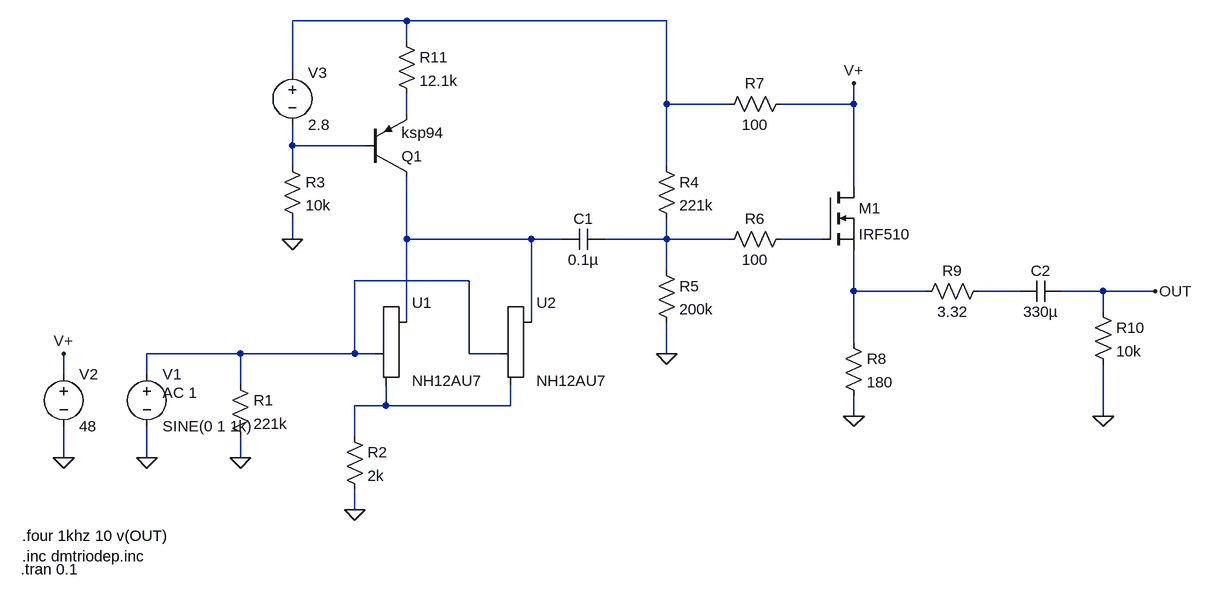
[diagram p0: schematic StarvingStudent_spice.asc]
StarvingStudent_spice.asc, the LTspice schematic file:
Version 4
SHEET 1 1892 680
WIRE 672 -624 496 -624
WIRE 1072 -624 672 -624
WIRE 672 -592 672 -624
WIRE 496 -544 496 -624
WIRE 1072 -496 1072 -624
WIRE 1168 -496 1072 -496
WIRE 1360 -496 1360 -528
WIRE 1360 -496 1248 -496
WIRE 672 -480 672 -512
WIRE 496 -432 496 -464
WIRE 608 -432 496 -432
WIRE 496 -400 496 -432
WIRE 1072 -400 1072 -496
WIRE 1360 -368 1360 -496
WIRE 496 -288 496 -320
WIRE 672 -288 672 -384
WIRE 864 -288 672 -288
WIRE 912 -288 864 -288
WIRE 1072 -288 1072 -320
WIRE 1072 -288 976 -288
WIRE 1168 -288 1072 -288
WIRE 1312 -288 1248 -288
WIRE 1072 -240 1072 -288
WIRE 768 -224 592 -224
WIRE 1360 -208 1360 -272
WIRE 1472 -208 1360 -208
WIRE 1616 -208 1552 -208
WIRE 1744 -208 1680 -208
WIRE 1824 -208 1744 -208
WIRE 1744 -176 1744 -208
WIRE 672 -160 672 -288
WIRE 864 -160 864 -288
WIRE 1360 -128 1360 -208
WIRE 416 -112 272 -112
WIRE 592 -112 592 -224
WIRE 592 -112 416 -112
WIRE 624 -112 592 -112
WIRE 768 -112 768 -224
WIRE 816 -112 768 -112
WIRE 1072 -112 1072 -160
WIRE 144 -80 144 -112
WIRE 272 -80 272 -112
WIRE 416 -64 416 -112
WIRE 640 -32 640 -64
WIRE 640 -32 592 -32
WIRE 832 -32 832 -64
WIRE 832 -32 640 -32
WIRE 1360 -16 1360 -48
WIRE 1744 -16 1744 -96
WIRE 592 16 592 -32
WIRE 144 48 144 0
WIRE 272 48 272 0
WIRE 416 48 416 16
WIRE 592 128 592 96
FLAG 416 48 0
FLAG 272 48 0
FLAG 592 128 0
FLAG 1072 -112 0
FLAG 1360 -528 V+
FLAG 1360 -16 0
FLAG 1744 -16 0
FLAG 1824 -208 OUT
FLAG 144 48 0
FLAG 144 -112 V+
FLAG 496 -288 0
SYMBOL res 400 -80 R0
SYMATTR InstName R1
SYMATTR Value 221k
SYMBOL voltage 272 -96 R0
WINDOW 123 24 44 Left 2
WINDOW 39 0 0 Left 0
SYMATTR InstName V1
SYMATTR Value SINE(0 1 1k)
SYMATTR Value2 AC 1
SYMBOL Misc\\triode 672 -112 R0
SYMATTR InstName U1
SYMATTR Value NH12AU7
SYMBOL Misc\\triode 864 -112 R0
SYMATTR InstName U2
SYMATTR Value NH12AU7
SYMBOL res 576 0 R0
SYMATTR InstName R2
SYMATTR Value 2k
SYMBOL cap 976 -304 R90
WINDOW 0 0 32 VBottom 2
WINDOW 3 32 32 VTop 2
SYMATTR InstName C1
SYMATTR Value 0.1µ
SYMBOL res 1056 -416 R0
SYMATTR InstName R4
SYMATTR Value 221k
SYMBOL res 1056 -256 R0
SYMATTR InstName R5
SYMATTR Value 200k
SYMBOL res 1264 -304 R90
WINDOW 0 0 56 VBottom 2
WINDOW 3 32 56 VTop 2
SYMATTR InstName R6
SYMATTR Value 100
SYMBOL nmos 1312 -368 R0
SYMATTR InstName M1
SYMATTR Value IRF510
SYMBOL res 1264 -512 R90
WINDOW 0 0 56 VBottom 2
WINDOW 3 32 56 VTop 2
SYMATTR InstName R7
SYMATTR Value 100
SYMBOL res 1344 -144 R0
SYMATTR InstName R8
SYMATTR Value 180
SYMBOL res 1568 -224 R90
WINDOW 0 0 56 VBottom 2
WINDOW 3 32 56 VTop 2
SYMATTR InstName R9
SYMATTR Value 3.32
SYMBOL cap 1680 -224 R90
WINDOW 0 0 32 VBottom 2
WINDOW 3 32 32 VTop 2
SYMATTR InstName C2
SYMATTR Value 330µ
SYMBOL res 1728 -192 R0
SYMATTR InstName R10
SYMATTR Value 10k
SYMBOL voltage 144 -96 R0
WINDOW 123 0 0 Left 0
WINDOW 39 0 0 Left 0
SYMATTR InstName V2
SYMATTR Value 48
SYMBOL pnp 608 -384 M180
SYMATTR InstName Q1
SYMATTR Value ksp94
SYMBOL res 480 -416 R0
SYMATTR InstName R3
SYMATTR Value 10k
SYMBOL voltage 496 -560 R0
WINDOW 123 0 0 Left 0
WINDOW 39 0 0 Left 0
SYMATTR InstName V3
SYMATTR Value 2.8
SYMBOL res 656 -608 R0
SYMATTR InstName R11
SYMATTR Value 12.1k
TEXT 80 200 Left 2 !.inc dmtriodep.inc
TEXT 78 220 Left 2 !.tran 0.1
TEXT 80 168 Left 2 !.four 1khz 10 v(OUT)

The netlist it stands for:
* StarvingStudent_spice.asc
R1 N007 0 221k
V1 N007 0 SINE(0 1 1k) AC 1
XU1 N004 N007 N010 NH12AU7
XU2 N004 N007 N010 NH12AU7
R2 N010 0 2k
C1 N005 N004 0.1µ
R4 N001 N005 221k
R5 N005 0 200k
R6 N006 N005 100
M1 V+ N006 N008 N008 IRF510
R7 V+ N001 100
R8 N008 0 180
R9 N009 N008 3.32
C2 OUT N009 330µ
R10 OUT 0 10k
V2 V+ 0 48
Q1 N004 N003 N002 0 ksp94
R3 N003 0 10k
V3 N001 N003 2.8
R11 N001 N002 12.1k
.model NPN NPN
.model PNP PNP
.lib standard.bjt
.model NMOS NMOS
.model PMOS PMOS
.lib standard.mos
.inc dmtriodep.inc
.tran 0.1
.four 1khz 10 v(OUT)
.backanno
.end